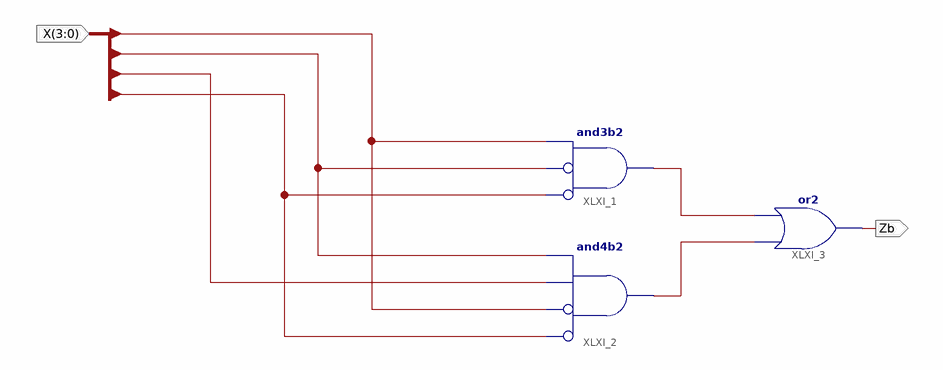
[diagram p0: schematic sheet 1]
// Xilinx ISE schematic b.sch (spartan3e) as structural Verilog: 3 symbols, 2 ports
module b (
  input  [3:0] X,
  output Zb
);

  wire XLXN_19, XLXN_20;

  and XLXI_1 (XLXN_19, ~X[3], ~X[1], X[0]);  // and3b2
  and XLXI_2 (XLXN_20, ~X[3], ~X[0], X[2], X[1]);  // and4b2
  or XLXI_3 (Zb, XLXN_20, XLXN_19);
endmodule
